# EAGLE design Quick Fix Mix (EAGLE 9.0.0)
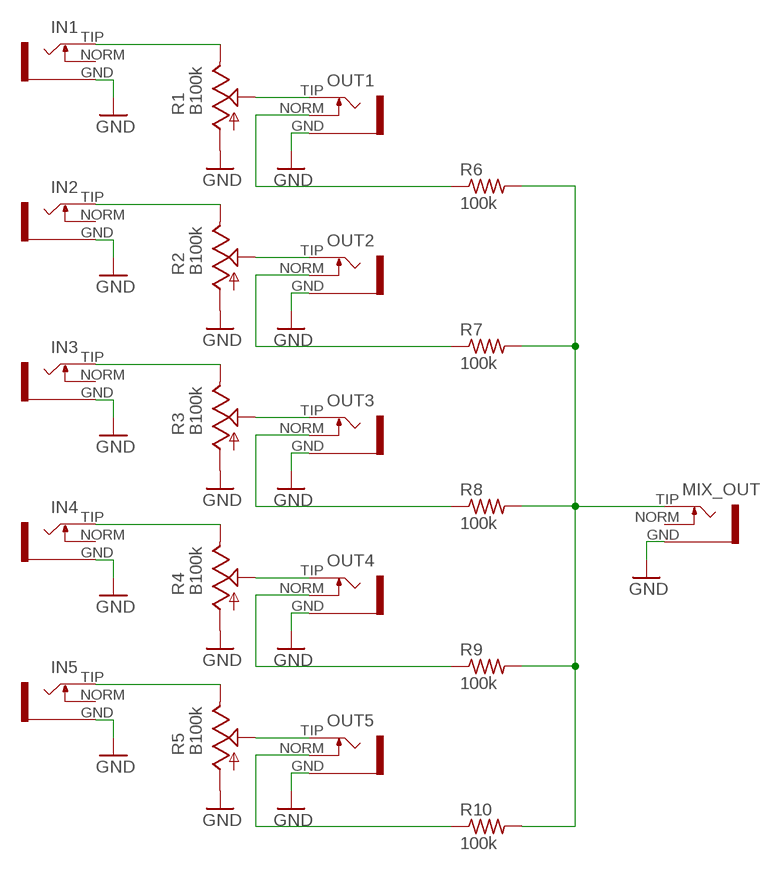
[diagram p0: schematic, sheet 1]

## Parts
IN1  INSTRUO_S_JACK_SMALL2  [INSTRUO_S_JACK_SMALL2]
IN2  INSTRUO_S_JACK_SMALL2  [INSTRUO_S_JACK_SMALL2]
IN3  INSTRUO_S_JACK_SMALL2  [INSTRUO_S_JACK_SMALL2]
IN4  INSTRUO_S_JACK_SMALL2  [INSTRUO_S_JACK_SMALL2]
IN5  INSTRUO_S_JACK_SMALL2  [INSTRUO_S_JACK_SMALL2]
MIX_OUT  INSTRUO_S_JACK_SMALL2  [INSTRUO_S_JACK_SMALL2]
OUT1  INSTRUO_S_JACK_S2_INV  [INSTRUO_S_JACK_S2_INV]
OUT2  INSTRUO_S_JACK_S2_INV  [INSTRUO_S_JACK_S2_INV]
OUT3  INSTRUO_S_JACK_S2_INV  [INSTRUO_S_JACK_S2_INV]
OUT4  INSTRUO_S_JACK_S2_INV  [INSTRUO_S_JACK_S2_INV]
OUT5  INSTRUO_S_JACK_S2_INV  [INSTRUO_S_JACK_S2_INV]
R1  B100k  OG-POTS_POT_USVERTICAL  [OG-POTS_ALPS_POT_VERTICAL]
R2  B100k  OG-POTS_POT_USVERTICAL  [OG-POTS_ALPS_POT_VERTICAL]
R3  B100k  OG-POTS_POT_USVERTICAL  [OG-POTS_ALPS_POT_VERTICAL]
R4  B100k  OG-POTS_POT_USVERTICAL  [OG-POTS_ALPS_POT_VERTICAL]
R5  B100k  OG-POTS_POT_USVERTICAL  [OG-POTS_ALPS_POT_VERTICAL]
R6  100k  R-US_R0603  [R0603]
R7  100k  R-US_R0603  [R0603]
R8  100k  R-US_R0603  [R0603]
R9  100k  R-US_R0603  [R0603]
R10  100k  R-US_R0603  [R0603]

## Nets
GND: IN1.GND IN2.GND IN3.GND IN4.GND IN5.GND MIX_OUT.GND OUT1.GND OUT2.GND OUT3.GND OUT4.GND OUT5.GND R1.P$3(A) R2.P$3(A) R3.P$3(A) R4.P$3(A) R5.P$3(A)
N$1: IN1.TIP R1.P$1(E)
N$2: OUT4.TIP R4.P$2(S)
N$3: IN2.TIP R2.P$1(E)
N$4: OUT3.TIP R3.P$2(S)
N$5: IN3.TIP R3.P$1(E)
N$6: OUT2.TIP R2.P$2(S)
N$7: IN4.TIP R4.P$1(E)
N$8: OUT1.TIP R1.P$2(S)
N$9: IN5.TIP R5.P$1(E)
N$10: OUT5.TIP R5.P$2(S)
N$11: OUT1.NORM R6.1
N$12: OUT2.NORM R7.1
N$13: OUT3.NORM R8.1
N$14: OUT4.NORM R9.1
N$15: OUT5.NORM R10.1
N$16: MIX_OUT.TIP R6.2 R7.2 R8.2 R9.2 R10.2
Unconnected: IN1.NORM IN2.NORM IN3.NORM IN4.NORM IN5.NORM MIX_OUT.NORM

## Library data of the parts
IN1-IN5 MIX_OUT = uClouds_002:INSTRUO_S_JACK_SMALL2
OUT1-OUT5 = uClouds_002:INSTRUO_S_JACK_S2_INV
R1-R5 = veils_v40:OG-POTS_POT_US
R6-R10 = adafruit:R-US_: RESISTOR, American symbol

## Board
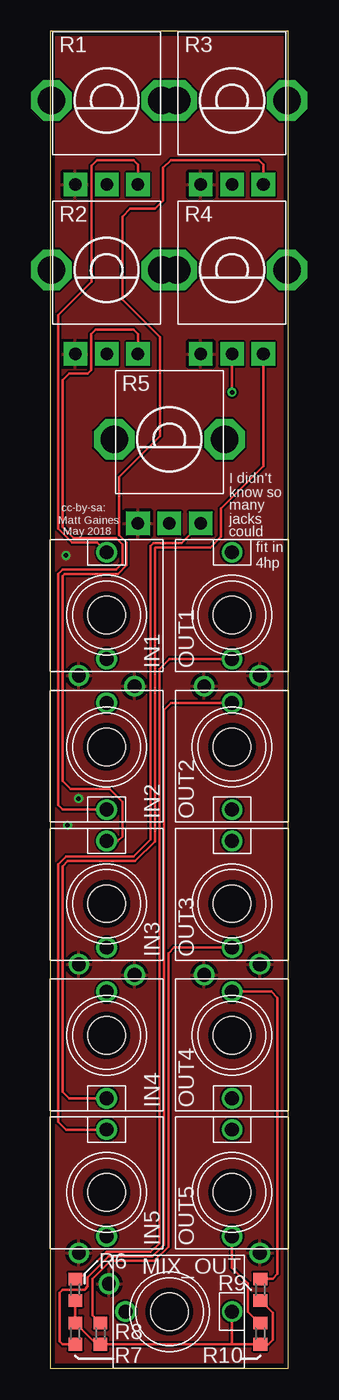
[diagram p1: board, top side]
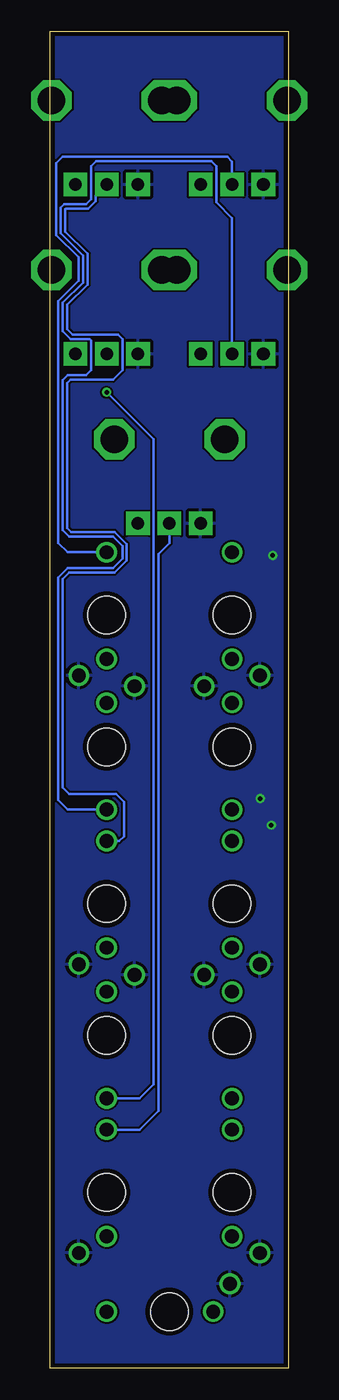
[diagram p2: board, bottom side, seen from below]

Size 19 x 106.5 mm. Coordinates in mm from the lower left corner, seen from the top.
Outline: 0,0 19,0 19,106.5 0,106.5 0,0
Copper layers (1*16): Top 0.0356mm / dielectric 1.5011mm / Bottom 0.0356mm
Design rules "oshpark-2layer": minimum track width 6mil, minimum drill 13mil, track to track 6mil, track to pad 6mil, pad to pad 6mil, via to via 6mil, smd to smd 6mil, copper to edge 15mil, drill to drill 6mil, minimum pad ring 7mil, minimum via ring 7mil, stop-mask expansion 2.5mil, vias tented up to drill 0mil, thermal gap 10mil
Holes 3 mm at 4.5,37 14.5,37 14.5,49.5 4.5,49.5 4.5,60 14.5,60 14.5,26.5 4.5,26.5 4.5,14 14.5,14 9.5,4.5

### Footprints (pad centres in the part's own frame; a part is rotated, then mirrored left to right if it is on the bottom)
INSTRUO_S_JACK_SMALL2 = drill 1.1: GND -2.223,-4.826; NORM 0,-3.5; TIP 0,5
INSTRUO_S_JACK_S2_INV = drill 1.1: GND 2.223,-4.826; NORM 0,-3.5; TIP 0,5
OG-POTS_ALPS_POT_VERTICAL = drill 1 pad 1.88 square: P$1 -2.5,6.7; P$2 0,6.7; P$3 2.5,6.7 | drill 2.2 pad 3.175 octagon: P$4 -4.4,0; P$5 4.4,0
R0603 = smd 1 x 1.1: 1 -0.85,0; 2 0.85,0

### Placement (x,y rotation side)
IN1  4.5,60 0 top
IN2  4.5,49.5 180 top
IN3  4.5,37 0 top
IN4  4.5,26.5 180 top
IN5  4.5,14 0 top
MIX_OUT  9.5,4.5 270 top
OUT1  14.5,60 0 top
OUT2  14.5,49.5 180 top
OUT3  14.5,37 0 top
OUT4  14.5,26.5 180 top
OUT5  14.5,14 0 top
R1  4.5,101 180 top
R2  4.5,87.5 180 top
R3  14.5,101 180 top
R4  14.5,87.5 180 top
R5  9.5,74 180 top
R6  2,6.25 270 top
R7  2,2.75 90 top
R8  4,2.75 270 top
R9  16.75,6.25 270 top
R10  16.75,2.75 270 top

### Tracks (layer width: path | path; a pad name or v marks a point on that pad's centre or on a via)
GND  (via drill 0.35)
  other vias: 1.38,43.25 1.25,64.75 2.25,45.38
  pour Top: -0.5,-1 19.5,-1 19.5,107 -0.5,107
  pour Bottom: -1,-1.5 20.5,-1.5 20.5,107.5 -1,107.5
N$1
  Top 0.203: R1.P$1 7,95.88 6.62,96.25 3.75,96.25 3.31,95.81 3.31,86.56 0.62,83.88 0.62,66.87 1.73,65.77 3.73,65.77 IN1.TIP
N$2  (via drill 0.35)
  Top 0.203: R4.P$2 v14.5,77.75
  Bottom 0.203: v14.5,77.75 10.75,74 10.75,22.62 11.88,21.5 OUT4.TIP
N$3
  Top 0.203: R2.P$1 7,82.38 6.62,82.75 3.62,82.75 3.25,82.38 3.25,79.5 3,79.25 1.5,79.25 0.98,78.73 0.98,67.02 1.88,66.12 5.25,66.12 5.75,65.62 5.75,64.12 5.25,63.62 1,63.62 0.62,63.25 0.62,44.88 1,44.5 IN2.TIP
N$4
  Bottom 0.203: OUT3.TIP 13.5,42 13.12,42.38 13.12,45.12 13.75,45.75 17.5,45.75 18.02,46.27 18.02,62.85 17.48,63.39 13.85,63.39 12.89,64.35 12.89,65.65 13.85,66.61 17.35,66.61 17.66,66.92 17.66,78.48 17.38,78.77 13.98,78.77 13.25,79.5 13.25,82 13.61,82.36 17.23,82.36 17.64,82.77 17.64,84.72 16.04,86.33 16.04,88.8 17.81,90.56 17.81,92.32 17.73,92.39 15.98,92.39 15.39,92.98 15.39,93.41 R3.P$2
N$5
  Top 0.203: R3.P$1 17,95.88 16.62,96.25 9.62,96.25 9,95.62 9,93 8.38,92.38 6.38,92.38 5.75,91.75 5.75,85.12 8.75,82.12 8.75,74.25 5.5,71 5.5,66.38 6.11,65.77 6.11,63.98 5.4,63.27 1.15,63.27 0.98,63.1 0.98,46.77 1.62,46.12 4.75,46.12 5.75,45.12 5.75,42.38 5.38,42 IN3.TIP
N$6
  Bottom 0.203: R2.P$2 4.5,91.62 5.75,92.88 5.75,95.75 6.14,96.14 15.36,96.14 15.75,95.75 15.75,93.12 16.12,92.75 17.88,92.75 18.16,92.46 18.16,90.42 16.39,88.65 16.39,86.48 18,84.87 18,82.62 17.38,82 15.88,82 15.75,81.88 15.75,79.5 16.12,79.12 17.62,79.12 18.02,78.73 18.02,66.77 17.5,66.25 14,66.25 13.25,65.5 13.25,64.5 14,63.75 17.62,63.75 18.38,63 18.38,45.25 17.62,44.5 OUT2.TIP
N$7
  Top 0.203: IN4.TIP 1.5,21.5 0.98,22.02 0.98,39.98 1.4,40.39 6.77,40.39 8.36,41.98 8.36,65.35 8.4,65.39 12.77,65.39 13.62,66.25 13.62,68.5 17,71.88 R4.P$1
N$8
  Bottom 0.203: R1.P$2 4.5,96.12 4.88,96.5 18,96.5 18.52,95.98 18.52,90.27 16.75,88.5 16.75,86.62 18.38,85 18.38,65.75 17.62,65 OUT1.TIP
N$9
  Top 0.203: R5.P$1 10.45,65.75 8.25,65.75 8,65.5 8,42.12 6.62,40.75 1.25,40.75 0.62,40.12 0.62,19.62 1.25,19 IN5.TIP
N$10
  Bottom 0.203: OUT5.TIP 11.88,19 10.38,20.5 10.38,64.88 9.5,65.75 R5.P$2
N$11
  Top 0.203: R6.1 2.35,7.1 4.5,9.25 8,9.25 8.71,9.96 8.71,55.71 9.5,56.5 OUT1.NORM
N$12
  Top 0.203: R7.1 0.97,1.9 0.75,2.12 0.75,6 1,6.25 2.75,6.25 3,6.5 3,7.25 4.65,8.89 8.15,8.89 9.07,9.81 9.07,52.44 9.62,53 OUT2.NORM
N$13
  Top 0.203: OUT3.NORM 9.88,33.5 9.42,33.05 9.42,9.67 8.29,8.54 4.79,8.54 3.38,7.12 3.38,4.22 R8.1
N$14
  Top 0.203: R9.1 16.77,7.12 17.75,7.12 18.12,7.5 18.12,29.5 17.62,30 OUT4.NORM
N$15
  Top 0.203: OUT5.NORM 14.5,8 15.75,6.75 15.75,4.5 16.65,3.6 R10.1
N$16
  Top 0.203: R6.2 R7.2 3.7,1.9 R8.2 4.02,1.88 8.42,1.88 | 8.4,1.9 8.42,1.88 | 8.42,1.88 10.58,1.88 10.6,1.9 14.5,1.9 | 14.5,1.9 R10.2 17.4,1.9 17.75,2.25 17.75,4.4 R9.2 | MIX_OUT.TIP 14.5,1.9

### Text on the board
tNames: I didn't | know so | cc-by-sa: | many | Matt Gaines | jacks | May 2018 | could | fit in | 4hp